# Altium project full wave rectifier circuit.PrjPcb
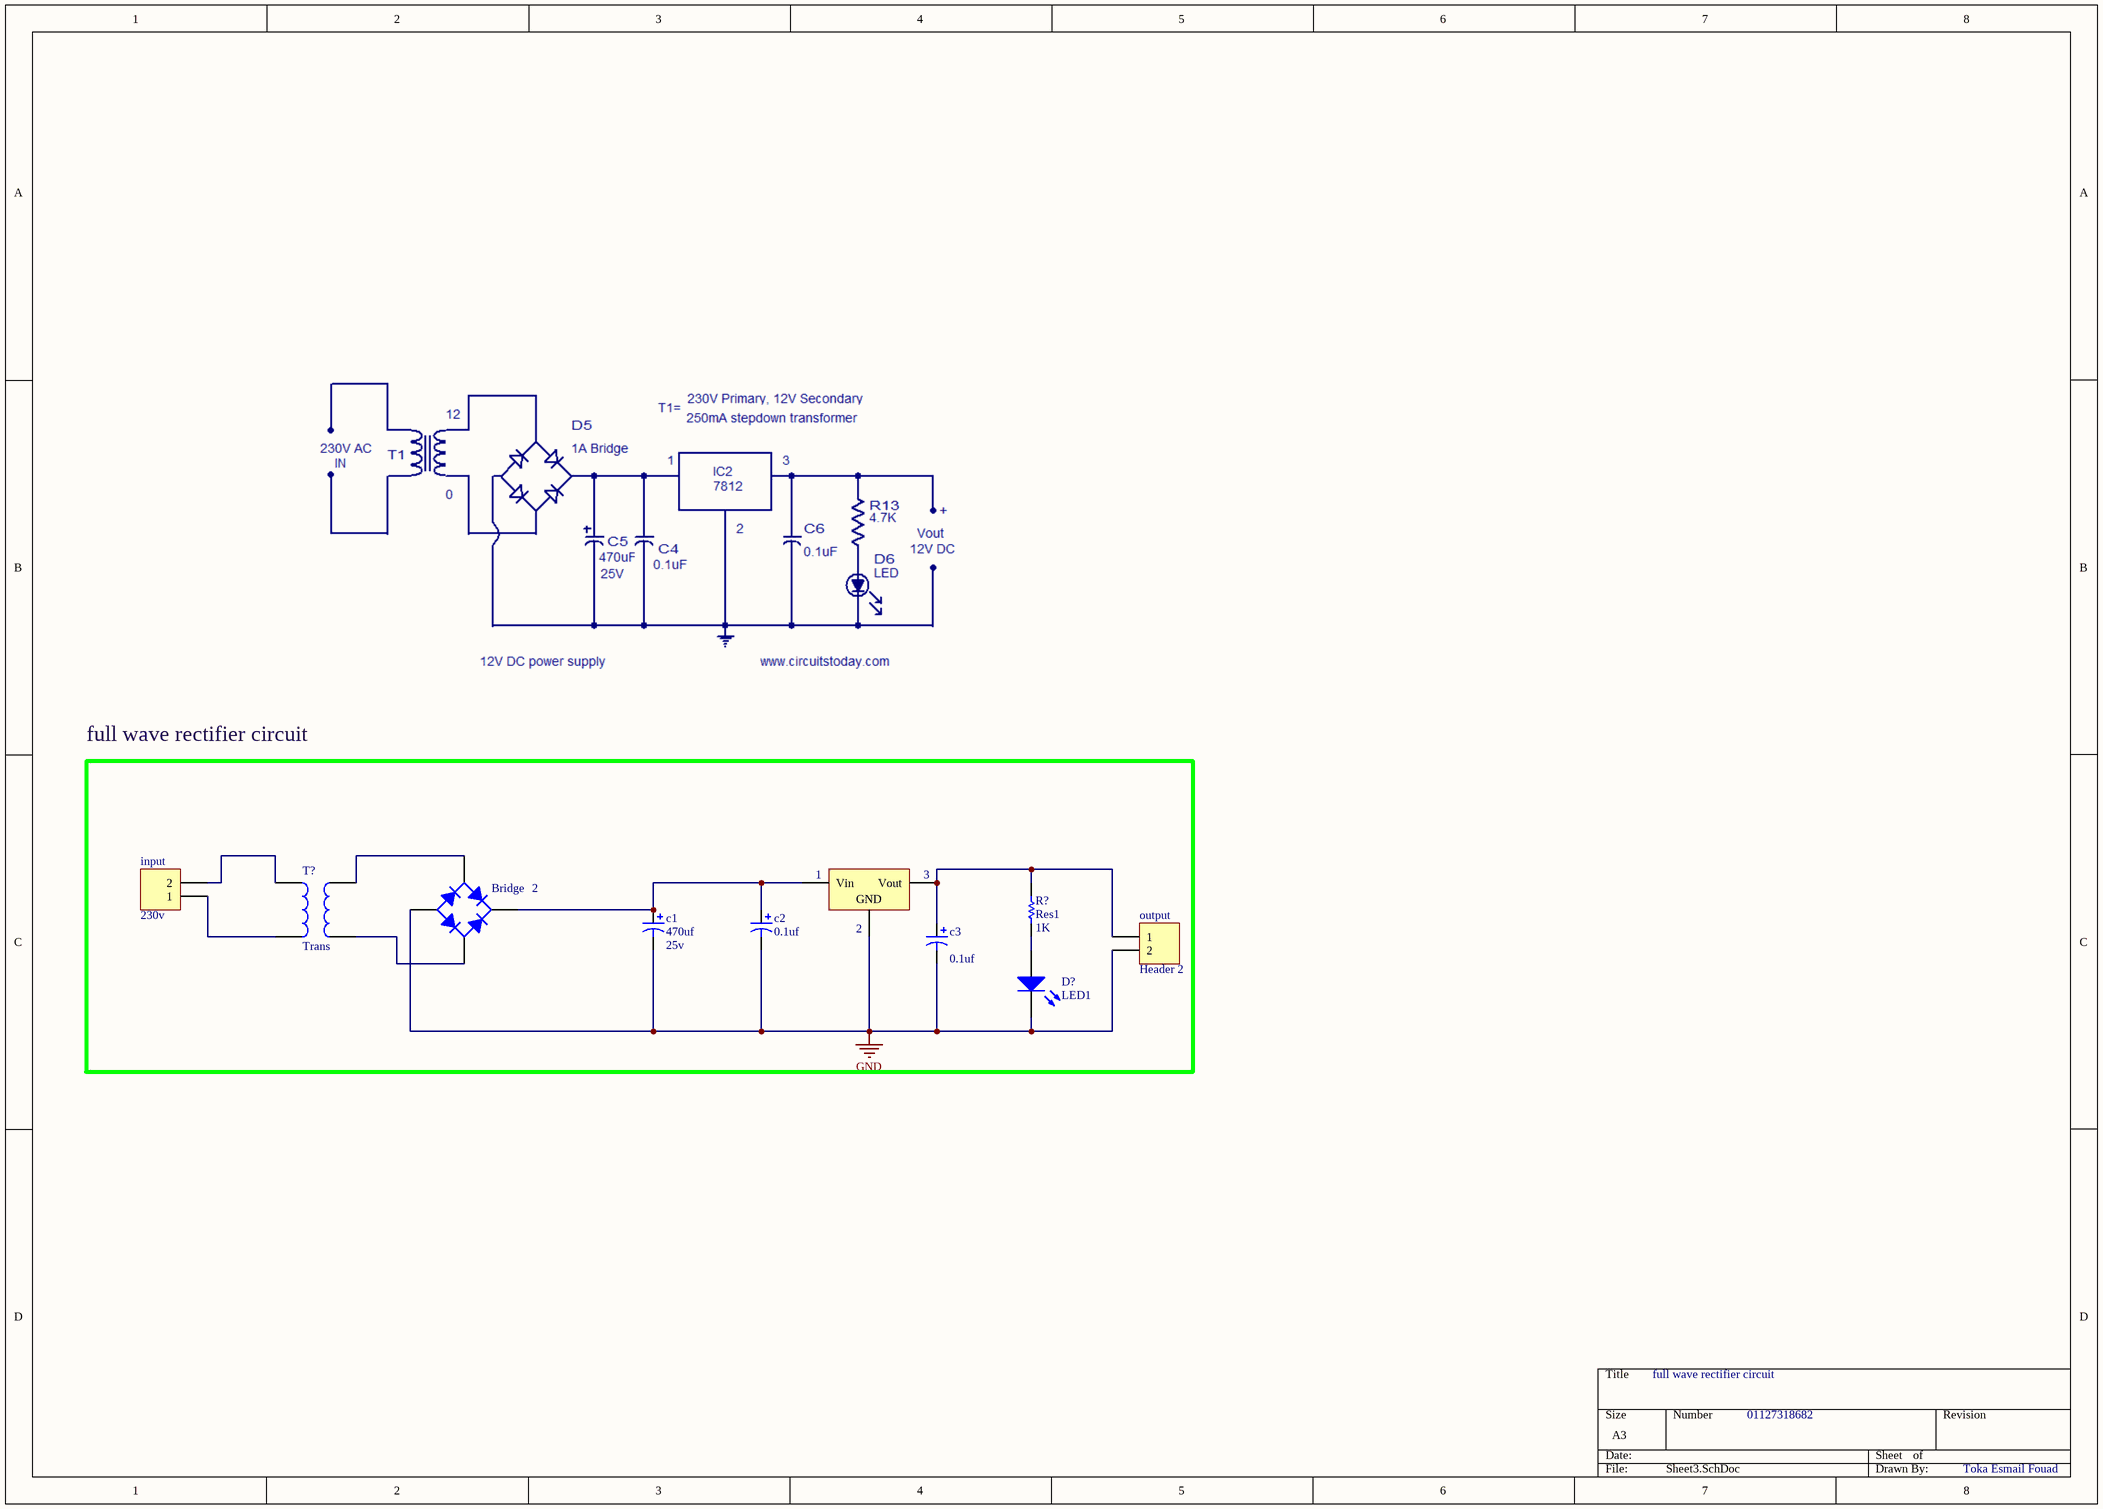
[diagram p0: Sheet3.SchDoc]
date: 8/8/2024; design: full wave rectifier circuit; desiner: Toka Esmail Fouad
1 sheet, 10 parts. Net scope: global (net labels, ports and power ports of the same name join across sheets).
Board file: PCB3.PcbDoc

## Sheet Sheet3.SchDoc
size A3; SheetNumber: 1; SheetTotal: 1; SPICEModelCacheORCFFQBC: <root> / <DocumentId>ORCFFQBC</DocumentId> / <CacheFrame Number="0"> / <Model Name="bridge" Kind="CKT"> / <Text>*Default Diode Bridge Rectifier / *Connections: / *              V- / *              | AC1 / *              | | V+ / *              | | | AC2 / *              | | | | / .SUBCKT BRIDGE 1 2 3 4 / D1 1 2 DMOD / D2 1 4 DMOD / D3 2 3 DMOD / D4 4 3 DMOD / .MODEL DMOD D () / .ENDS BRIDGE</Text> / </Model> / <Model Name="cap" Kind="MDL"> / <Text>*Default semiconductor capacitor / .MODEL CAP C()</Text> / </Model> / <Model Name="led1" Kind="MDL"> / <Text>*Typ RED GaAs LED: Vf=1.7V Vr=4V If=40mA trr=3uS / *LED Pinout: 1=A, 2=K / .MODEL LED1 D (IS=93.2P RS=42M N=3.73 BV=4 IBV=10U / + CJO=2.97P VJ=.75 M=.333 TT=4.32U)</Text> / </Model> / </CacheFrame> / </root>

### Parts
1  3  [D2PAK_N]
2  Bridge  [D-38]
c1  470uf  value 25v  [RB7.6-15]
c2  0.1uf  [RB7.6-15]
c3  2  value 0.1uf  [RB7.6-15]
D?  LED1  [LED-1]
input  230v  [HDR1X2]
output  Header 2  [HDR1X2]
R?  Res1  value 1K  [AXIAL-0.3]
T?  Trans  [TRANS]

### Blocks framed on the sheet
full wave rectifier circuit: 1 2 c1-c3 D? input output R? T?

### Nets
GND: 1.2(GND) 2.3(A) c1.2 c2.2 c3.2 D?.2(K) output.2
Net1_1: 1.1(Vin) 2.1(K) c1.1 c2.1
Net1_3: 1.3(Vout) c3.1 output.1 R?.2
Net2_2: 2.2(C) T?.4
Net2_4: 2.4(C) T?.3
NetD?_1: D?.1(A) R?.1
Netinput_1: input.1 T?.2
Netinput_2: input.2 T?.1

### Notes on the sheet
- full wave rectifier circuit
- 01127318682
- Toka Esmail Fouad

### Library data of the parts
1 = Volt Reg: Voltage Regulator; Published: 24-Mar-1999; LatestRevisionDate: 29-May-2009; LatestRevisionNote: IPC-7351 Footprint Added.; PackageReference: D2PAK; Publisher: Altium Limited; PackageDescription: 3-Pin Transistor Outline Package 2.54 mm Pitch, 15.1 mm Lead Span
2 = Bridge1: Full Wave Diode Bridge; Published: 8-Jun-2000; LatestRevisionDate: 29-May-2009; LatestRevisionNote: Sch pins A & K swapped.; DatasheetVersion: E2732B; PackageReference: D-38; Publisher: Altium Limited; PackageDescription: Bridge Rectifier; 4 Terminals; Body 9.4 x 9.4 mm (typ); Pitch 5.08 mm
c1-c3 = Cap Pol1: Polarized Capacitor (Radial); Published: 8-Jun-2000; LatestRevisionDate: 17-Jul-2002; LatestRevisionNote: Re-released for DXP Platform.; PackageReference: RB7.6-15; Publisher: Altium Limited; PackageDescription: Polarized Capacitor (Radial); 2 Leads
D? = LED1: Typical RED GaAs LED; Published: 8-Jun-2000; LatestRevisionDate: 08-Jul-2005; LatestRevisionNote: Mech Layer 1 removed.; PackageReference: LED-1; Publisher: Altium Limited; PackageDescription: LED; 2 Leads
input output = Header 2: Header, 2-Pin; LatestRevisionDate: 17-Jul-2002; LatestRevisionNote: Re-released for DXP Platform.; Publisher: Altium Limited
R? = Res1: Resistor; Published: 8-Jun-2000; LatestRevisionDate: 17-Jul-2002; LatestRevisionNote: Re-released for DXP Platform.; PackageReference: AXIAL-0.3; Publisher: Altium Limited; PackageDescription: Axial Device, Thru-Hole; 2 Leads; 0.3 in Pin Spacing
T? = Trans: Transformer; Published: 24-Mar-1999; LatestRevisionDate: 08-Jul-2005; LatestRevisionNote: Mech Layer 1 removed.; PackageReference: TRANS; Publisher: Altium Limited; PackageDescription: Transformer; 4 Leads